# EAGLE design tapeint (EAGLE 7.6.0)
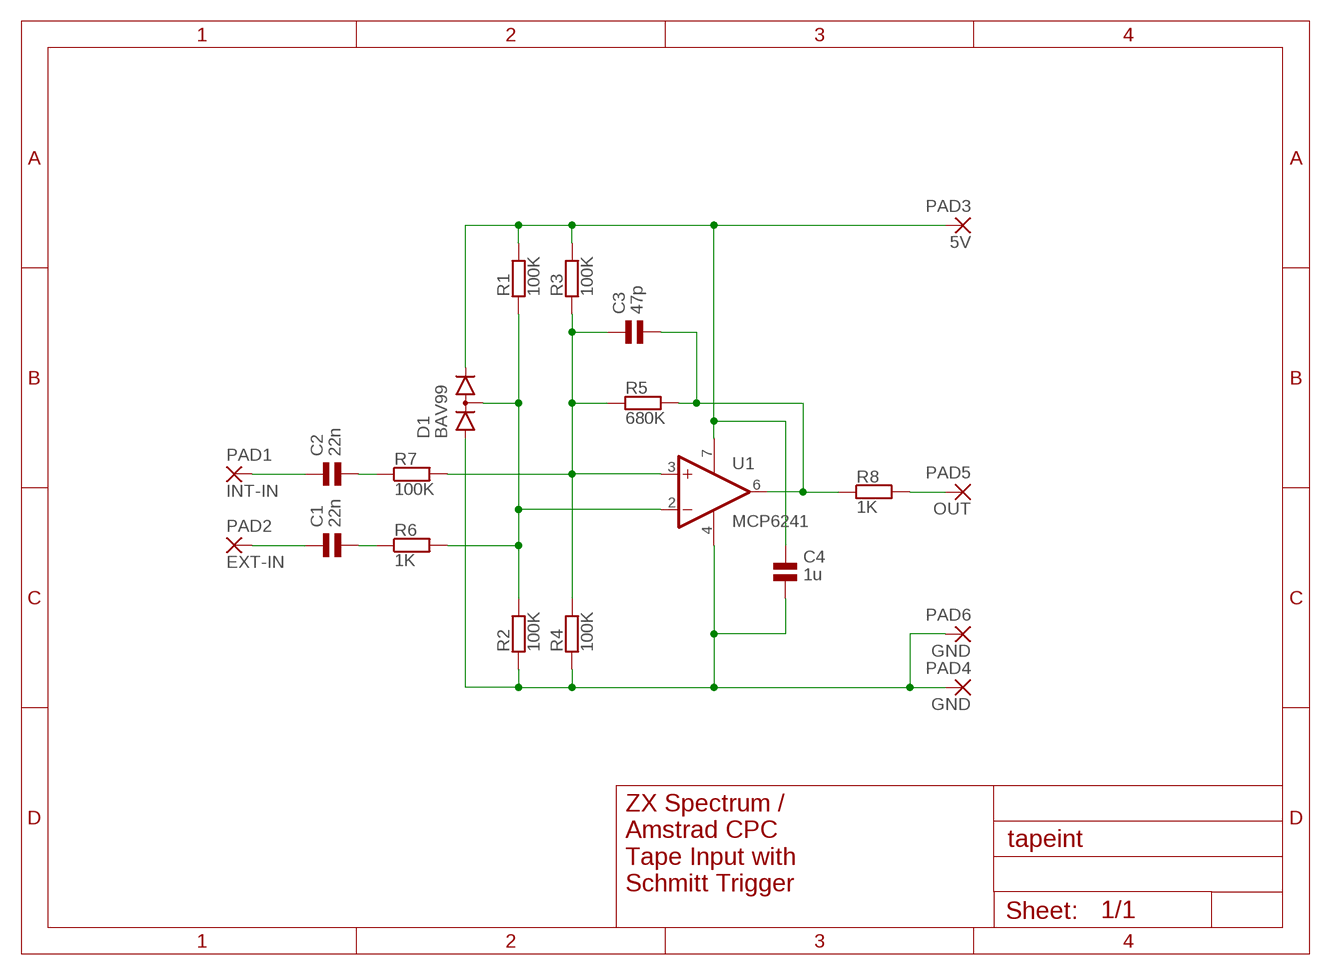
[diagram p0: schematic, sheet 1]

## Parts
C1  22n  CAP_NPOL-0805  [0805]
C2  22n  CAP_NPOL-0805  [0805]
C3  47p  CAP_NPOL-0805  [0805]
C4  1u  CAP_NPOL-0805  [0805]
D1  BAV99  [SOT23]
PAD1  INT-IN  WIREPAD2,54/1,0  [2,54/1,0]
PAD2  EXT-IN  WIREPAD2,54/1,0  [2,54/1,0]
PAD3  5V  WIREPAD2,54/1,0  [2,54/1,0]
PAD4  GND  WIREPAD2,54/1,0  [2,54/1,0]
PAD5  OUT  WIREPAD2,54/1,0  [2,54/1,0]
PAD6  GND  WIREPAD2,54/1,0  [2,54/1,0]
R1  100K  RES-SMD_0805  [0805]
R2  100K  RES-SMD_0805  [0805]
R3  100K  RES-SMD_0805  [0805]
R4  100K  RES-SMD_0805  [0805]
R5  680K  RES-SMD_0805  [0805]
R6  1K  RES-SMD_0805  [0805]
R7  100K  RES-SMD_0805  [0805]
R8  1K  RES-SMD_0805  [0805]
U1  MCP6241  1AMP_P7+4D  [SO08]

## Nets
+5V: C4.1 D1.2(K2) PAD3.1(P) R1.2 R3.2 U1.7(V+)
GND: C4.2 D1.1(A1) PAD4.1(P) PAD6.1(P) R2.1 R4.1 U1.4(V-)
N$1: PAD5.1(P) R8.2
N$3: D1.3(K1A2) R1.1 R2.2 R6.2 U1.2(-IN)
N$4: C3.1 R3.1 R4.2 R5.1 R7.2 U1.3(+IN)
N$6: C1.1 PAD2.1(P)
N$7: C1.2 R6.1
N$8: C2.1 PAD1.1(P)
N$9: C2.2 R7.1
OUT: C3.2 R5.2 R8.1 U1.6(OUT)

## Notes on the sheet
- ZX Spectrum /
  Amstrad CPC
  Tape Input with
  Schmitt Trigger

## Library data of the parts
C1-C4 = jc-passive:CAP_NPOL
D1 = jc-discretesemi:BAV99
PAD1-PAD6 = wirepad:WIREPAD: Wire PAD connect wire on PCB
R1-R8 = jc-passive:RES
U1 = jc:1AMP_P7+4: OP AMP

## Board
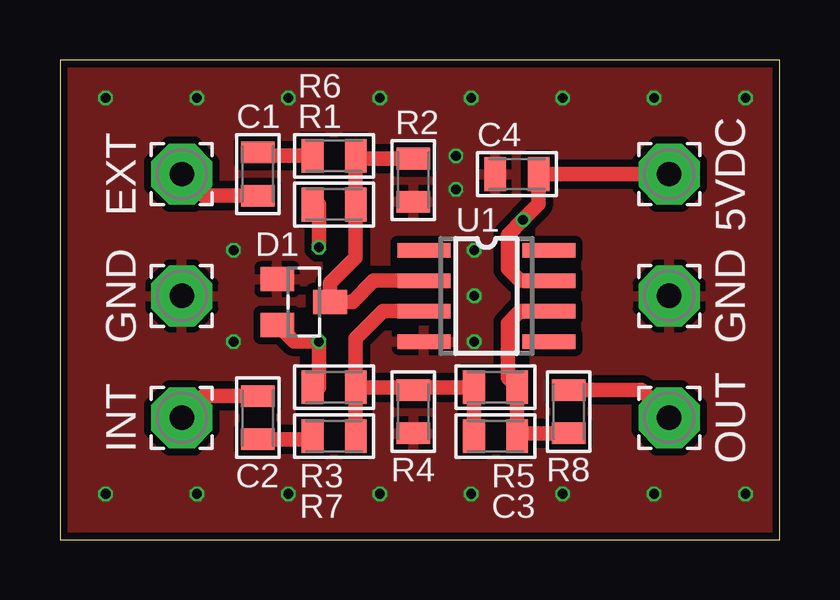
[diagram p1: board, top side]
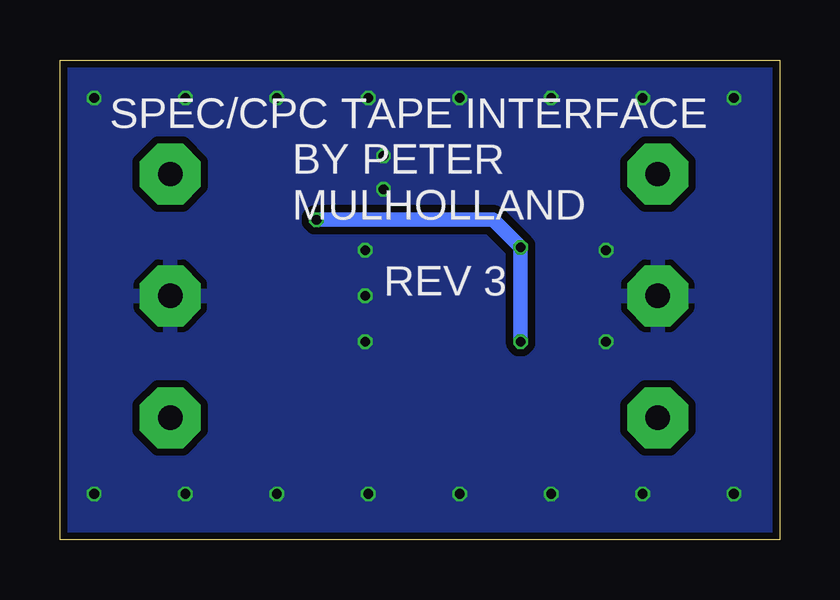
[diagram p2: board, bottom side, seen from below]

Size 30 x 20 mm. Coordinates in mm from the lower left corner, seen from the top.
Outline: 0,0 30,0 30,20 0,20 0,0
Copper layers (1*16): Top 0.035mm / dielectric 0.2mm / Bottom 0.035mm
Design rules "jlcpcb-2layers": minimum track width 3.5mil, minimum drill 0.2mm, track to track 5mil, track to pad 5mil, pad to pad 5mil, via to via 5mil, smd to smd 0mil, copper to edge 0.1mm, drill to drill 5mil, minimum pad ring 4mil, minimum via ring 4mil, stop-mask expansion 3mil, vias tented up to drill 100mil, thermal gap 10mil

### Footprints (pad centres in the part's own frame; a part is rotated, then mirrored left to right if it is on the bottom)
0805 = smd 0.9 x 1.4: 1 -0.9,0; 2 0.9,0
SOT23 = smd 1 x 1.4: 1 -0.95,-1.1; 2 0.95,-1.1; 3 0,1.1
2,54/1,0 = drill 1.016 pad 2.54 octagon: 1 0,0
SO08 = smd 0.6 x 2.2: 1 -1.905,-2.6; 2 -0.635,-2.6; 3 0.635,-2.6; 4 1.905,-2.6; 5 1.905,2.6; 6 0.635,2.6; 7 -0.635,2.6; 8 -1.905,2.6

### Placement (x,y rotation side)
C1  8.26,15.24 90 top
C2  8.26,5.08 270 top
C3  18.16,4.32 0 top
C4  19.05,15.24 180 top
D1  10.16,9.91 270 top
PAD1  5.08,5.08 90 top
PAD2  5.08,15.24 0 top
PAD3  25.4,15.24 0 top
PAD4  25.4,10.16 0 top
PAD5  25.4,5.08 0 top
PAD6  5.08,10.16 0 top
R1  11.43,13.97 180 top
R2  14.73,14.99 90 top
R3  11.43,6.35 180 top
R4  14.73,5.33 90 top
R5  18.16,6.35 0 top
R6  11.43,16 0 top
R7  11.43,4.32 0 top
R8  21.21,5.33 90 top
U1  17.78,10.16 270 top

### Tracks (layer width: path | path; a pad name or v marks a point on that pad's centre or on a via)
+5V  (via drill 0.4)
  Top 0.61: D1.2 9.76,8.26 v10.79,8.26 10.79,6.35 R3.2 | U1.7 19.18,10.79 18.67,11.3 18.67,12.7 v19.3,13.34 19.95,13.98 C4.1 PAD3.1 | R1.2 10.79,13.97 v10.79,12.19
  Bottom 0.61: v19.3,13.34 11.94,13.34 v10.79,12.19 v10.79,8.26
GND  (via drill 0.4)
  other vias: 17.27,8.26 16.51,14.61 16.51,16 7.24,8.26 7.24,12.06 17.27,10.16 17.27,12.06 1.91,18.41 5.71,18.41 9.53,18.41 13.34,18.41 17.14,18.41 20.95,18.41 24.77,18.41 28.57,18.41 1.91,1.91 5.71,1.91 9.53,1.91 13.34,1.91 17.14,1.91 20.95,1.91 24.77,1.91 28.57,1.91
  pour Bottom (isolate 0.305): 0,20.32 30.48,20.32 30.48,0 0,0
  pour Top (isolate 0.305): 0,0 0,20.32 30.48,20.32 30.48,0
N$1
  Top 0.61: R8.2 24.25,6.23 PAD5.1
N$3
  Top 0.61: U1.2 13.08,10.79 12.19,9.91 D1.3 11.26,10.69 12.33,11.76 R1.1 R6.2 12.33,15.89 R2.2
N$4
  Top 0.61: U1.3 13.46,9.53 12.33,8.39 R3.1 | 14.73,6.35 R3.1 | R4.2 14.73,6.35 | 14.73,6.35 R5.1 C3.1 | R7.2 R3.1
N$6
  Top 0.61: PAD2.1 5.98,14.34 C1.1
N$7
  Top 0.61: C1.2 8.26,16 R6.1
N$8
  Top 0.61: PAD1.1 5.98,5.98 C2.1
N$9
  Top 0.61: C2.2 10.53,4.18 R7.1
OUT
  Top 0.61: U1.6 19.18,9.53 18.67,9.02 18.67,6.74 R5.2 C3.2 19.06,4.43 R8.1

### Text on the board
tPlace: EXT | 5VDC | GND | GND | INT | OUT
bPlace: SPEC/CPC TAPE INTERFACE | BY PETER / MULHOLLAND | REV 3